# EAGLE design GBPCB (EAGLE 9.6.2)
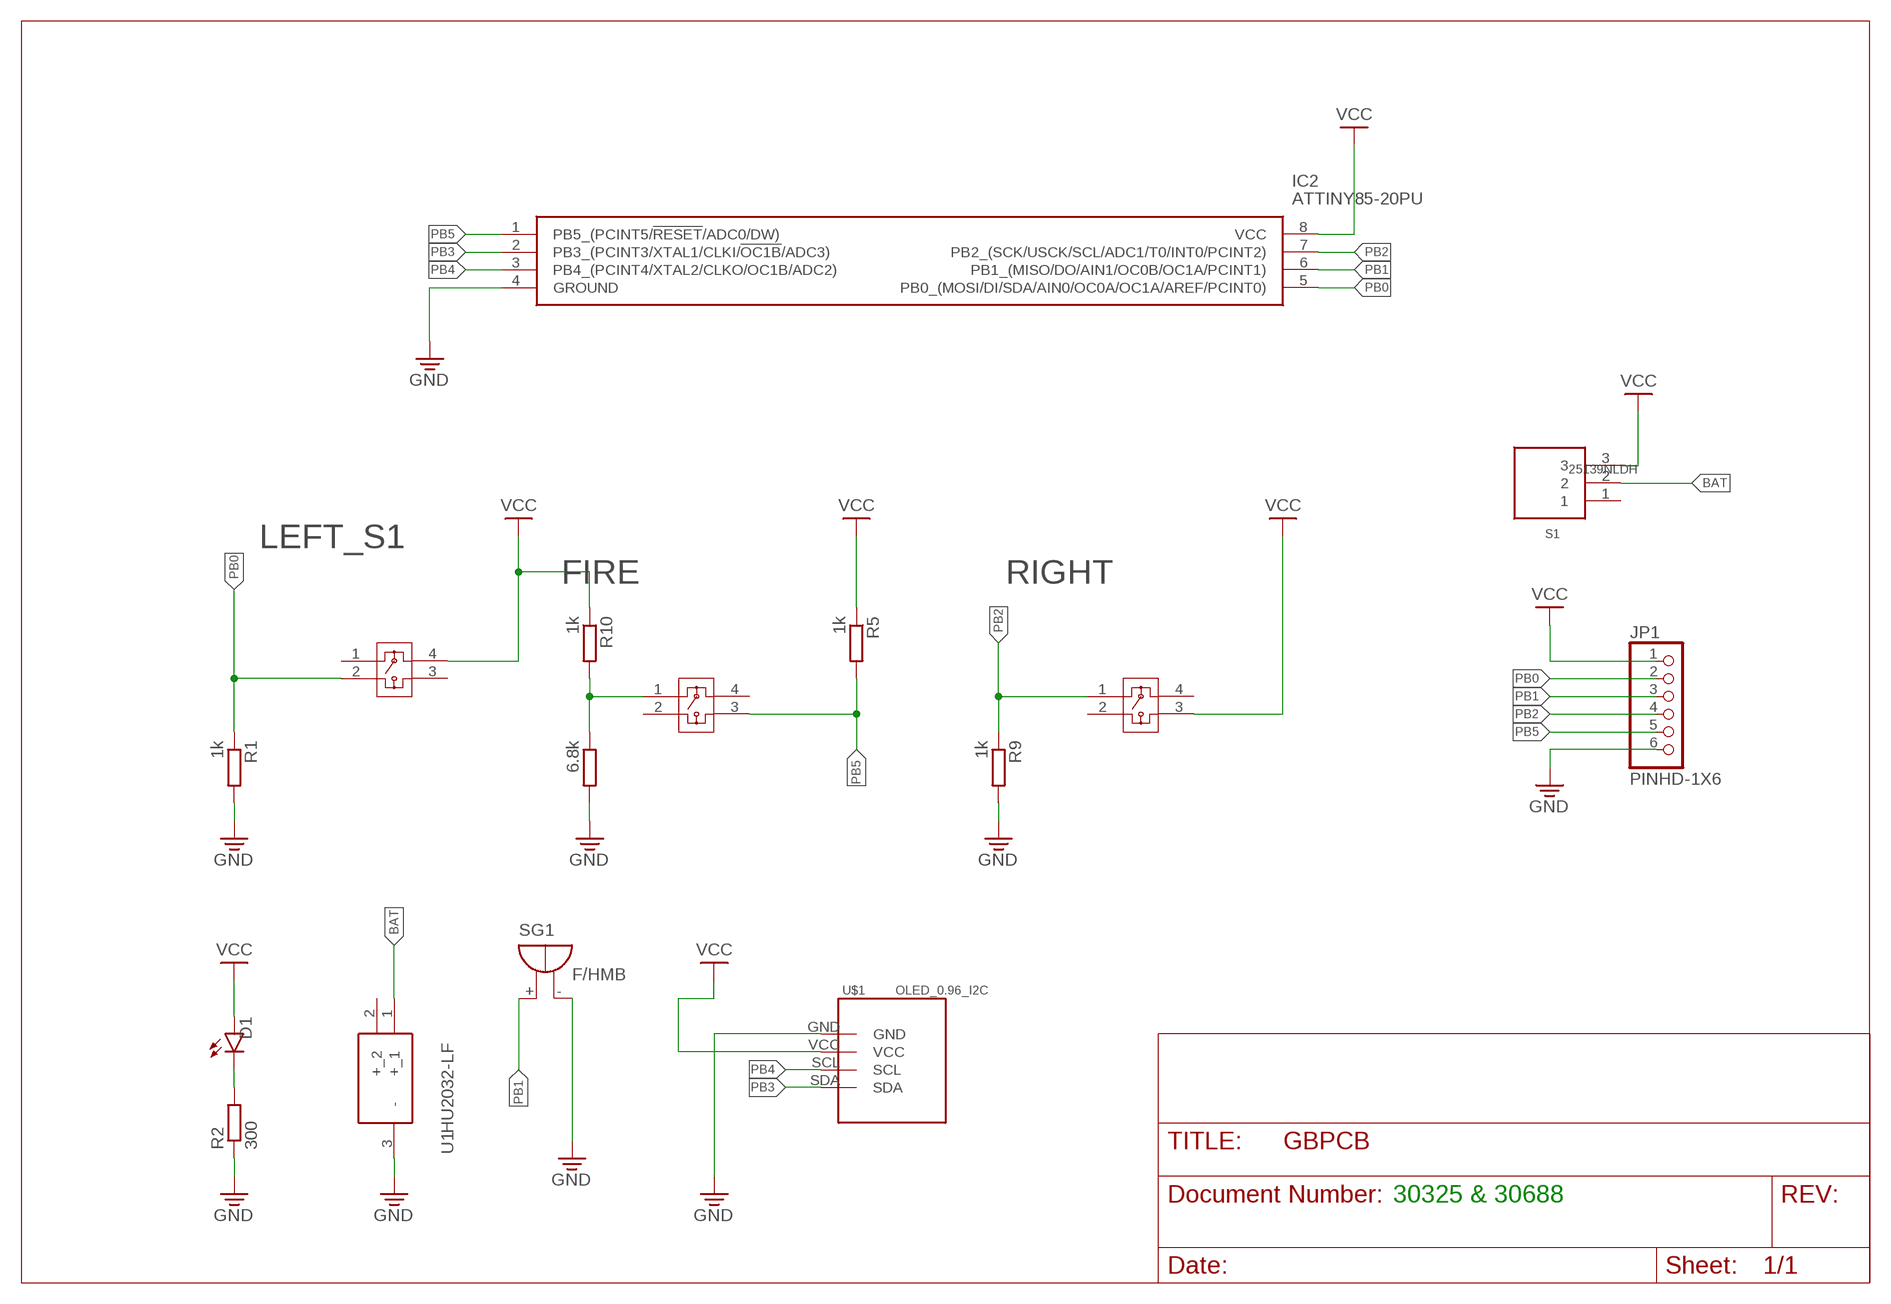
[diagram p0: schematic, sheet 1]

## Parts
D1  LED_GREEN  LEDCHIPLED_1206  [CHIPLED_1206]
FIRE  COM-10302COM-10302_SPK  [COM-10302_SPK]
IC2  ATTINY85-20PU  [DIP781W56P254L950H533Q8N]
JP1  PINHD-1X6  [1X06]
LEFT_S1  COM-10302COM-10302_SPK  [COM-10302_SPK]
R1  1k  R-EU_R1206  [R1206]
R2  300  R-EU_R1206  [R1206]
R4  6.8k  R-EU_R1206  [R1206]
R5  1k  R-EU_R1206  [R1206]
R9  1k  R-EU_R1206  [R1206]
R10  1k  R-EU_R1206  [R1206]
RIGHT  COM-10302COM-10302_SPK  [COM-10302_SPK]
S1  25139NLDH  [25139NLDH]
SG1  F/HMB  [F/HMB]
U1  HU2032-LF  [HU2032LF]
U$1  OLED_0.96_I2C  [OLED_0.96_I2C]

## Nets
BAT: S1.2 U1.1(+_1)
DGND: U$1.GND ; supply symbol labelled GND
GND: IC2.4(GROUND) JP1.6 R1.2 R2.1 R4.2 R9.2 SG1.- U1.3(-)
N$1: FIRE.1 R4.1 R10.2
N$3: D1.C R2.2
PB0: IC2.5(PB0_(MOSI/DI/SDA/AIN0/OC0A/OC1A/AREF/PCINT0)) JP1.2 LEFT_S1.2 R1.1
PB1: IC2.6(PB1_(MISO/DO/AIN1/OC0B/OC1A/PCINT1)) JP1.3 SG1.+
PB2: IC2.7(PB2_(SCK/USCK/SCL/ADC1/T0/INT0/PCINT2)) JP1.4 R9.1 RIGHT.1
PB3: IC2.2(PB3_(PCINT3/XTAL1/CLKI/!OC1B!/ADC3)) U$1.SDA
PB4: IC2.3(PB4_(PCINT4/XTAL2/CLKO/OC1B/ADC2)) U$1.SCL
PB5: FIRE.3 IC2.1(PB5_(PCINT5/!RESET!/ADC0/DW)) JP1.5 R5.2
VCC: D1.A IC2.8(VCC) JP1.1 LEFT_S1.4 R5.1 R10.1 RIGHT.3 S1.3 U$1.VCC
Unconnected: FIRE.2 FIRE.4 LEFT_S1.1 LEFT_S1.3 RIGHT.2 RIGHT.4 S1.1 U1.2(+_2)

## Notes on the sheet
- 30325 & 30688

## Library data of the parts
D1 = led:LED: LED OSRAM: - CHIPLED LG R971, LG N971, LY N971, LG Q971, LY Q971, LO R971, LY R971 LH N974, LH R974 LS Q976, LO Q976, LY Q976 LO Q996 - Hyper CHIPLED LW Q18S LB Q993, LB Q99A, LB R99A - SideLED LS A670, LO A670, LY A670, LG A670, LP A670 LB A673, LV A673, LT A673, LW A673 LH A674 LY A675 LS A676, LA A676, LO A676, LY A676, LW A676 LS A679, LY A679, LG A679 - Hyper Micro SIDELED® LS Y876, LA Y876, LO Y876, LY Y876 LT Y87S - SmartLED LW L88C, LW L88S LB L89C, LB L89S, LG L890 LS L89K, LO L89K, LY L89K LS L896, LA L896, LO L896, LY L896 - TOPLED LS T670, LO T670, LY T670, LG T670, LP T670 LSG T670, LSP T670, LSY T670, LOP T670, LYG T670 LG T671, LOG T671, LSG T671 LB T673, LV T673, LT T673, LW T673 LH T674 LS T676, LA T676, LO T676, LY T676, LB T676, LH T676, LSB T676, LW T676 LB T67C, LV T67C, LT T67C, LS T67K, LO T67K, LY T67K, LW E67C LS E67B, LA E67B, LO E67B, LY E67B, LB E67C, LV E67C, LT E67C LW T67C LS T679, LY T679, LG T679 LS T770, LO T770, LY T770, LG T770, LP T770 LB T773, LV T773, LT T773, LW T773 LH T774 LS E675, LA E675, LY E675, LS T675 LS T776, LA T776, LO T776, LY T776, LB T776 LHGB T686 LT T68C, LB T68C - Hyper Mini TOPLED® LB M676 - Mini TOPLED Santana® LG M470 LS M47K, LO M47K, LY M47K Source: http://www.osram.convergy.de LUXEON: - LUMILED® LXK2-PW12-R00, LXK2-PW12-S00, LXK2-PW14-U00, LXK2-PW14-V00 LXK2-PM12-R00, LXK2-PM12-S00, LXK2-PM14-U00 LXK2-PE12-Q00, LXK2-PE12-R00, LXK2-PE12-S00, LXK2-PE14-T00, LXK2-PE14-U00 LXK2-PB12-K00, LXK2-PB12-L00, LXK2-PB12-M00, LXK2-PB14-N00, LXK2-PB14-P00, LXK2-PB14-Q00 LXK2-PR12-L00, LXK2-PR12-M00, LXK2-PR14-Q00, LXK2-PR14-R00 LXK2-PD12-Q00, LXK2-PD12-R00, LXK2-PD12-S00 LXK2-PH12-R00, LXK2-PH12-S00 LXK2-PL12-P00, LXK2-PL12-Q00, LXK2-PL12-R00 Source: www.luxeon.com KINGBRIGHT: KA-3528ASYC Source: www.kingbright.com
FIRE LEFT_S1 RIGHT = 2023-10-24_09-55-51_Library:COM-10302; COPYRIGHT: Copyright (C) 2023 Ultra Librarian. All rights reserved.; MANUFACTURER_PART_NUMBER: COM-10302; MFR_NAME: Sparkfun
IC2 = ATTINY85-20PU:ATTINY85-20PU: MICROCHIP - ATTINY85-20PU - MICROCONTROLLER MCU, 8 BIT, ATTINY, 20MHZ, DIP-8 Source: Datasheet <https://componentsearchengine.com/Datasheets/2/ATTINY85-20PU.pdf>; DESCRIPTION: MICROCHIP - ATTINY85-20PU - MICROCONTROLLER MCU, 8 BIT, ATTINY, 20MHZ, DIP-8; HEIGHT: 5.334mm; MANUFACTURER_NAME: Microchip; MANUFACTURER_PART_NUMBER: ATTINY85-20PU; MOUSER_PART_NUMBER: 556-ATTINY85-20PU; MOUSER_PRICE-STOCK: https://www.mouser.co.uk/ProductDetail/Microchip-Technology/ATTINY85-20PU?qs=8jWQYweyg6NCiiaOb5GI9Q%3D%3D
JP1 = Connector:PINHD-1X6: PIN HEADER; CATEGORY: Headers; DESCRIPTION: Header, Straight, 6 Position; MANUFACTURER: Generic; MPN: Generic; OPERATING_TEMPERATURE: Generic; PART_STATUS: Active; PITCH: 0.100" (2.54mm); ROHS_COMPLIANCE: Generic; SERIES: Generic; SUB-CATEGORY: Headers, Male Pins; TYPE: Board to Board or Cable, Unshrouded, Through Hole, Straight
R1 R2 R4 R5 R9 R10 = rcl:R-EU_: RESISTOR, European symbol; SPICEPREFIX: R
S1 = 25139NLDH:25139NLDH: Slide Switches SPDT 0.4VA 20VAC/DC On-Off-On Source: Datasheet <https://www.mouser.com/datasheet/2/26/PCB-slideswitches-serie-25000N-1511380.pdf>; DESCRIPTION: Slide Switches SPDT 0.4VA 20VAC/DC On-Off-On; HEIGHT: 8.1mm; MANUFACTURER_NAME: Apem; MANUFACTURER_PART_NUMBER: 25139NLDH; MOUSER_PART_NUMBER: 642-25139NLDH; MOUSER_PRICE-STOCK: https://www.mouser.com/Search/Refine.aspx?Keyword=642-25139NLDH
SG1 = buzzer:F/HMB: BUZZER Source: Buerklin; OC_FARNELL: unknown; OC_NEWARK: unknown
U1 = HU2032-LF:HU2032-LF: RENATA - HU2032-LF - HOLDER, BATTERY, THT, CR2032 Source: Datasheet <https://componentsearchengine.com/Datasheets/2/HU2032-LF.pdf>; DESCRIPTION: RENATA - HU2032-LF - HOLDER, BATTERY, THT, CR2032; HEIGHT: mm; MANUFACTURER_NAME: RENATA; MANUFACTURER_PART_NUMBER: HU2032-LF; MOUSER_PART_NUMBER: 614-HU2032-LF; MOUSER_PRICE-STOCK: https://www.mouser.co.uk/ProductDetail/Renata/HU2032-LF?qs=oUsD4qhOtFwA99zRPu3JIQ%3D%3D
U$1 = tft_1_8_1_44_oled_0_96:OLED_0.96_I2C

## Board
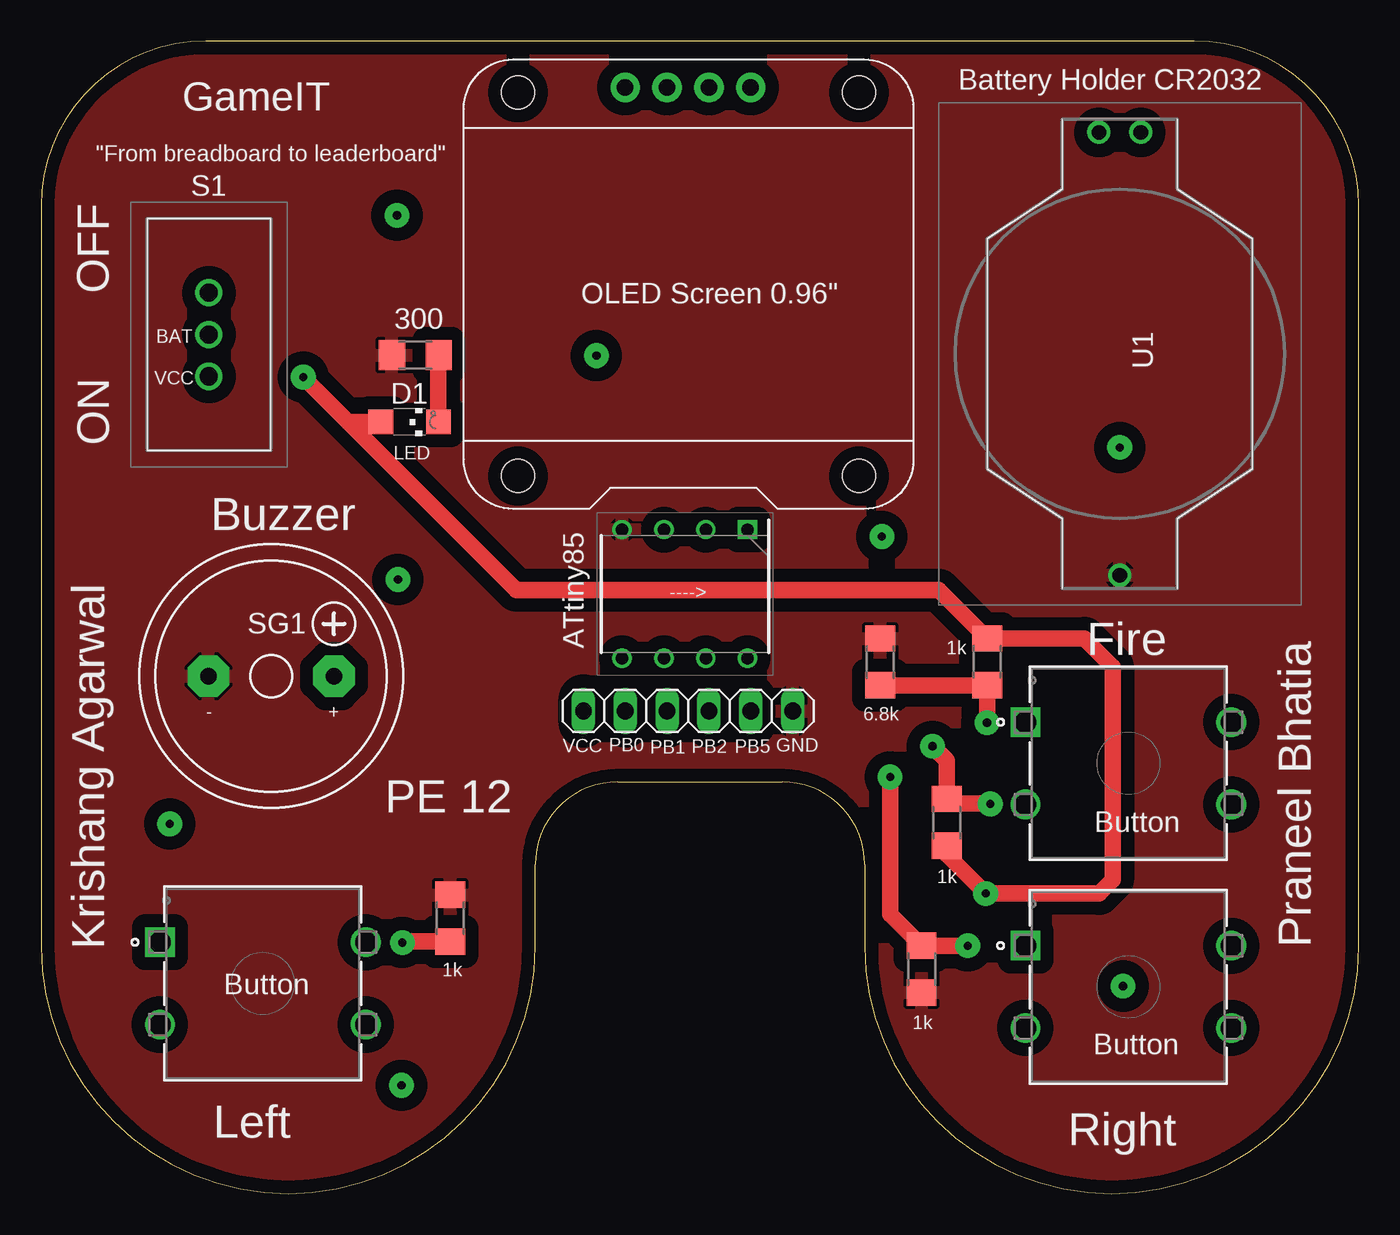
[diagram p1: board, top side]
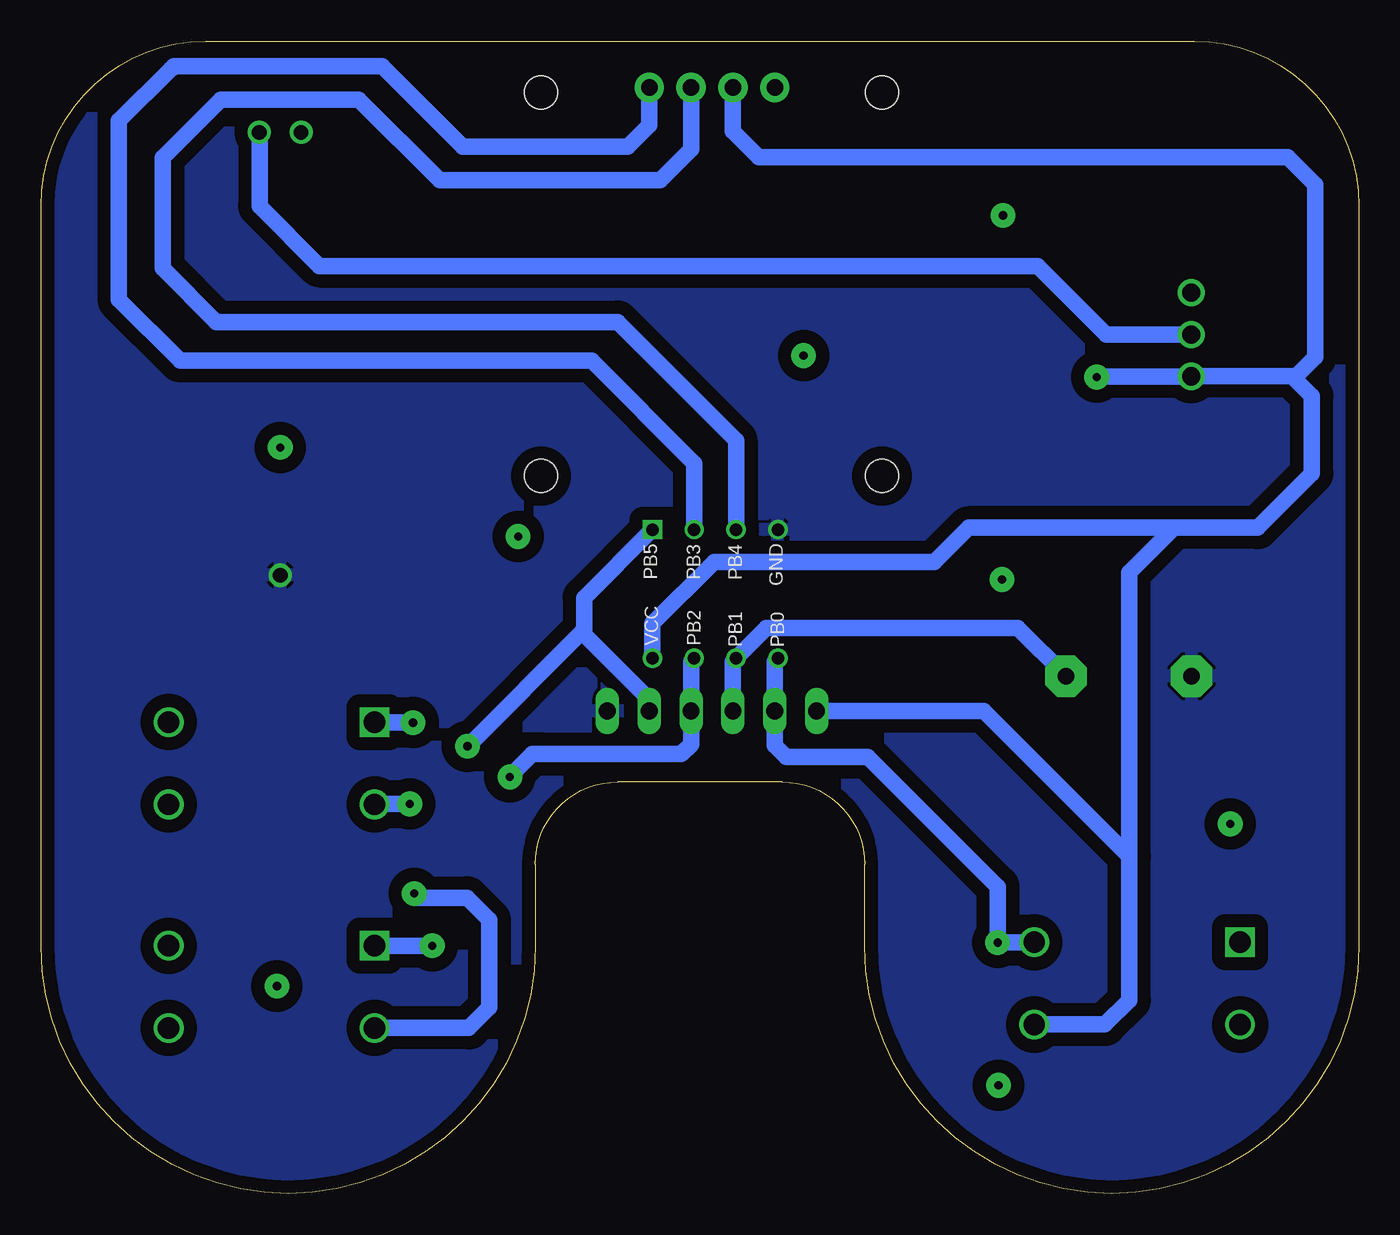
[diagram p2: board, bottom side, seen from below]

Size 80 x 70 mm. Coordinates in mm from the lower left corner, seen from the top.
Outline: 35,25 45,25 arc-90 50,20 50,15 arc180 80,15 80,60 arc90 70,70 10,70 arc90 0,60 0,15 arc180 30,15 30,20 arc-90 35,25
Copper layers (1*16): Top 0.035mm / dielectric 1.5mm / Bottom 0.035mm
Design rules "DesignRules": minimum track width 6mil, minimum drill 12mil, track to track 6mil, track to pad 6mil, pad to pad 6mil, via to via 6mil, smd to smd 6mil, copper to edge 20mil, drill to drill 8mil, minimum pad ring 8mil, minimum via ring 6mil, stop-mask expansion 3mil, vias tented up to drill 0mil, thermal gap 8mil

### Footprints (pad centres in the part's own frame; a part is rotated, then mirrored left to right if it is on the bottom)
CHIPLED_1206 = smd 1.5 x 1.5: A 0,-1.75; C 0,1.75
COM-10302_SPK = drill 1.295 pad 1.803 square: 1 0,0 | drill 1.295 pad 1.803: 2 12.5,0; 3 0,-5; 4 12.5,-5
DIP781W56P254L950H533Q8N = drill 0.759 pad 1.159 square: 1 -3.905,3.81 | drill 0.759 pad 1.159: 2 -3.905,1.27; 3 -3.905,-1.27; 4 -3.905,-3.81; 5 3.905,-3.81; 6 3.905,-1.27; 7 3.905,1.27; 8 3.905,3.81
1X06 = drill 1.016 long: 1 -6.35,0; 2 -3.81,0; 3 -1.27,0; 4 1.27,0; 5 3.81,0; 6 6.35,0
R1206 = smd 1.6 x 1.803: 1 -1.422,0; 2 1.422,0
25139NLDH = drill 1.1 pad 1.65: 1 0,0; 2 0,-2.54; 3 0,-5.08
F/HMB = drill 1.016 pad 2.54 octagon: + 3.81,0; - -3.81,0
HU2032LF = drill 0.9 pad 1.4: 1 0,0; 2 0,-2.54; 3 26.9,-1.27
OLED_0.96_I2C = drill 1 pad 1.778: GND -4.17,11.63; SCL 0.91,11.63; SDA 3.45,11.63; VCC -1.63,11.63 | hole 2: -10.67,-11.97; 10.03,-11.97; 10.03,11.33; -10.67,11.33

### Placement (x,y rotation side)
D1  22.37,46.87 270 top
FIRE  59.76,28.64 0 top
IC2  39.08,36.43 270 top
JP1  39.27,29.32 0 top
LEFT_S1  7.21,15.27 0 top
R1  24.84,16.73 90 top
R2  22.72,50.93 0 top
R4  50.94,32.29 90 top
R5  54.98,22.55 90 top
R9  53.46,13.64 270 top
R10  57.44,32.3 270 top
RIGHT  59.76,15.06 0 top
S1  10.18,54.72 0 top
SG1  13.97,31.43 0 top
U1  66.76,64.46 270 top
U$1  39.63,55.56 0 top

### Tracks (layer width: path | path; a pad name or v marks a point on that pad's centre or on a via)
BAT
  Bottom 0.152: S1.2
  Bottom 0.8: 66.74,64.44 U1.1 | 19.6,56.34 19.49,56.34
  Bottom 1: 66.74,64.44 66.74,59.98 63.1,56.34 19.6,56.34 | 19.49,56.34 15.33,52.18 14.86,52.18 S1.2
GND
  pour Bottom (isolate 0.8): -2.58,74.14 84.24,73.87 85.05,-3.26 -7.32,-4.75 -6.99,73.99 -2.5,74.12
  pour Top (isolate 0.8): -12.43,78.28 90.34,80.56 90.83,-9.78 -14.81,-10.92
N$1  (via drill 0.5 pad 1.5)
  Top 0.152: R4.1
  Top 0.8: 57.44,28.64 v57.41,28.62 v57.42,28.61
  Top 1: 57.44,28.64 R10.2 R4.1
  Bottom 0.152: FIRE.1 59.73,28.61
  Bottom 1: 59.73,28.61 v57.42,28.61
N$2  (via drill 0.5 pad 1.5)
  other vias: 7.81,22.45
N$3
  Top 0.8: R2.2 24.12,50.91
  Top 1: 24.12,50.91 D1.C
N$4  (via drill 0.5 pad 1.5)
  other vias: 21.6,59.42
N$5  (via drill 0.5 pad 1.5)
  other vias: 65.48,45.32
N$6  (via drill 0.5 pad 1.5)
  other vias: 33.71,50.91
N$7  (via drill 0.5 pad 1.5)
  other vias: 21.88,6.58
N$8  (via drill 0.5 pad 1.5)
  other vias: 65.69,12.6
N$9  (via drill 0.5 pad 1.5)
  other vias: 21.66,37.31
N$10  (via drill 0.5 pad 1.5)
  other vias: 51.04,39.91
PB0  (via drill 0.5 pad 1.5)
  Top 1: v21.93,15.25 21.99,15.31 R1.1
  Bottom 0.152: 21.91,15.27 v21.93,15.25
  Bottom 1: IC2.5 35.46,32.33 JP1.2 35.46,27.23 34.77,26.54 29.82,26.54 21.92,18.64 v21.92,15.26 v21.93,15.25 | LEFT_S1.2 21.91,15.27
PB1
  Bottom 0.152: 38,32.33 IC2.6
  Bottom 1: SG1.+ 20.71,34.37 35.97,34.37 IC2.6 | JP1.3 38,32.33
PB2  (via drill 0.5 pad 1.5)
  Top 0.8: v56.25,15.06
  Top 1: v56.25,15.06 R9.1 51.54,16.97 v51.54,25.31
  Bottom 0.8: 49.64,26.71 49.65,26.71
  Bottom 1: v56.25,15.06 v56.26,15.06 RIGHT.1 | v51.54,25.31 51.54,25.35 50.19,26.71 49.64,26.71 | 49.65,26.71 41.12,26.71 40.54,27.29 JP1.4 40.54,32.33 IC2.7
PB3
  Bottom 0.152: 71.95,68.48 72.14,68.3
  Bottom 1: U$1.SDA 43.08,64.9 44.4,63.59 54.4,63.59 59.3,68.48 70,68.48 71.95,68.48 | 72.14,68.3 75.28,65.16 75.28,54.3 71.56,50.59 46.58,50.59 40.35,44.35 IC2.2
PB4
  Bottom 1: U$1.SCL 40.54,63.44 42.42,61.56 55.81,61.56 60.71,66.45 69.09,66.45 72.63,62.91 72.63,56.21 69.37,52.95 45.01,52.95 37.81,45.75 IC2.3
PB5  (via drill 0.5 pad 1.5)
  Top 0.8: 55.24,23.71 R5.2
  Top 1: 55.24,23.71 57.58,23.71 v57.62,23.67 | R5.2 54.98,26.31 v54.12,27.17
  Bottom 0.152: v54.12,27.17
  Bottom 0.8: 59.51,23.67 59.54,23.64
  Bottom 1: 59.54,23.64 FIRE.3 | v57.62,23.67 59.51,23.67 | 47.18,34.11 47.03,34.26 47.03,36.19 IC2.1 | 47.18,34.11 43.08,30.01 JP1.5 | 47.18,34.11 v54.12,27.17
VCC  (via drill 0.5 pad 1.5)
  Top 0.152: 18.69,46.87 18.67,46.85
  Top 1: v15.92,49.59 18.67,46.85 28.85,36.66 54.5,36.66 R10.1 63.33,33.72 65.05,32 65.05,19.05 64.23,18.23 v57.35,18.23 54.98,20.6 R5.1 | D1.A 18.69,46.87
  Bottom 0.152: 15.87,49.64 v15.92,49.59 | 3.81,49.65 4.06,49.65 | S1.3
  Bottom 0.8: 2.85,43.72 2.85,43.75
  Bottom 1: 11.21,40.46 6.14,40.46 2.85,43.75 2.85,48.44 4.06,49.65 S1.3 | 11.21,40.46 23.69,40.46 25.77,38.38 39.13,38.38 42.89,34.62 IC2.8 | 11.21,40.46 13.93,37.74 13.93,20.48 | v57.35,18.23 57.09,17.97 54.14,17.97 52.79,16.62 52.79,11.3 54.03,10.06 RIGHT.3 | LEFT_S1.4 15.42,10.27 13.93,11.75 13.93,20.48 | JP1.1 22.77,29.31 13.93,20.48 | U$1.VCC 38,64.53 36.42,62.95 4.33,62.95 2.65,61.28 2.65,50.81 3.81,49.65 | S1.3 15.87,49.64

### Text on the board
tPlace: Battery Holder CR2032 | GameIT | "From breadboard to leaderboard" | OFF | OLED Screen 0.96" | 300 | BAT | VCC | D1 | ON | LED | Buzzer | ----> | Fire | ATtiny85 | 1k | - | + | 6.8k | VCC | PB0 | PB1 | PB2 | PB5 | GND | PE 12 | Button | 1k | Krishang Agarwal | Praneel Bhatia | 1k | Button | 1k | Button | Left | Right
bPlace: GND | PB4 | PB3 | PB5 | PB0 | PB1 | PB2 | VCC